# Altium schematic sheet 407-power.schdoc
size A4
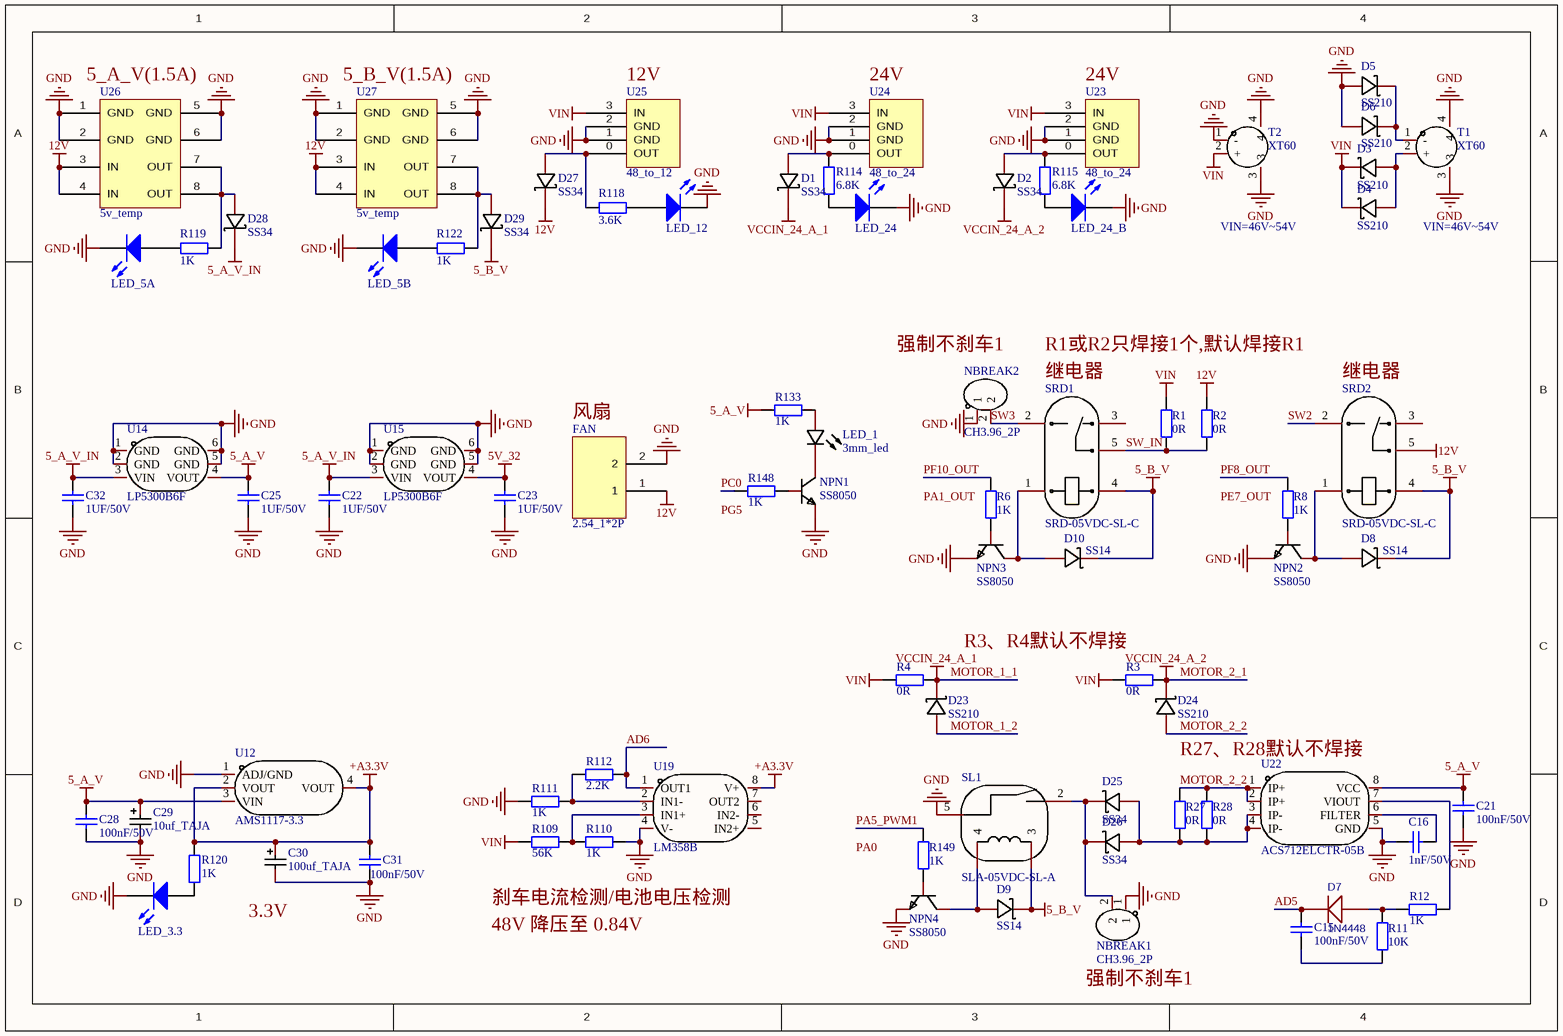
[diagram p0: 407-power.schdoc]

## Parts
C15  100nF/50V
C16  1nF/50V
C21  100nF/50V
C22  1UF/50V
C23  1UF/50V
C25  1UF/50V
C28  100nF/50V
C29  10uf_TAJA  [10uf_TAJA]
C30  100uf_TAJA  [100uf_TAJA]
C31  100nF/50V
C32  1UF/50V
D1  SS34  [SS34]
D2  SS34  [SS34]
D3  SS210  [SS210]
D4  SS210  [SS210]
D5  SS210  [SS210]
D6  SS210  [SS210]
D7  1N4448
D8  SS14  [SS14]
D9  SS14  [SS14]
D10  SS14  [SS14]
D23  SS210  [SS210]
D24  SS210  [SS210]
D25  SS34  [SS34]
D26  SS34  [SS34]
D27  SS34  [SS34]
D28  SS34  [SS34]
D29  SS34  [SS34]
FAN  2.54_1*2P  [2.54_1*2P]
LED_1  3mm_led  [3mm_led]
LED_3.3  LED  [LED]  (value not drawn)
LED_5A  LED  [LED]  (value not drawn)
LED_5B  LED  [LED]  (value not drawn)
LED_12  LED  [LED]  (value not drawn)
LED_24  LED  [LED]  (value not drawn)
LED_24_B  LED  [LED]  (value not drawn)
NBREAK1  CH3.96_2P  [CH3.96_2P]
NBREAK2  CH3.96_2P
NPN1  SS8050  [SS8050]
NPN2  SS8050  [SS8050]
NPN3  SS8050  [SS8050]
NPN4  SS8050  [SS8050]
R1  0R  [R1206_M]
R2  0R  [R1206_M]
R3  0R  [R1206_M]
R4  0R  [R1206_M]
R6  1K
R8  1K
R11  10K
R12  1K
R27  0R  [R1206_M]
R28  0R  [R1206_M]
R109  56K  [R0603_L]
R110  1K  [R0603_L]
R111  1K  [R0603_L]
R112  2.2K  [R0603_L]
R114  6.8K
R115  6.8K
R118  3.6K
R119  1K
R120  1K
R122  1K
R133  1K
R148  1K
R149  1K
SL1  SLA-05VDC-SL-A  [SLA-05VDC-SL-A]
SRD1  SRD-05VDC-SL-C  [SRD-05VDC-SL-C]
SRD2  SRD-05VDC-SL-C  [SRD-05VDC-SL-C]
T1  XT60
T2  XT60
U12  AMS1117-3.3  [AMS1117-3.3]
U14  LP5300B6F  [LP5300B6F]
U15  LP5300B6F  [LP5300B6F]
U19  LM358B  [LM358B]
U22  ACS712ELCTR-05B  [ACS712ELCTR-05B]
U23  48_to_24  [48_to_24]
U24  48_to_24  [48_to_24]
U25  48_to_12  [48_to_12]
U26  5v_temp  [5v_temp]
U27  5v_temp  [5v_temp]

## Nets
5_A_V: C21.2 C25.2 C28.1 C29.1 R133.2 U12.3(VIN) U14.4(VOUT) U22.8(VCC)
5_A_V_IN: C22.2 C32.2 D28.1(K) U14.3(VIN) U15.3(VIN)
5_B_V: D8.1(K) D9.1(K) D10.1(K) D29.1(K) SL1.3 SRD1.4 SRD2.4
5V_32: C23.2 U15.4(VOUT)
12V: D27.1(K) FAN.1 R2.1 SRD2.5 U26.3(IN) U26.4(IN) U27.3(IN) U27.4(IN)
+A3.3V: C30.1 C31.1 R120.1 U12.2(VOUT) U12.4(VOUT) U19.8(V+)
GND: C16.2 C21.1 C22.1 C23.1 C25.1 C28.2 C29.2 C30.2 C31.2 C32.1 D5.2(A) D6.2(A) FAN.2 LED_3.3.2(K) LED_5A.2(K) LED_5B.2(K) LED_12.2(K) LED_24.2(K) LED_24_B.2(K) NBREAK1.1 NBREAK2.1 NPN1.2(E) NPN2.2(E) NPN3.2(E) NPN4.2(E) R110.1 R111.2 SL1.5 T1.3 T1.4 T2.1(-) T2.3 T2.4 U12.1(ADJ/GND) U14.1(GND) U14.2(GND) U14.5(GND) U14.6(GND) U15.1(GND) U15.2(GND) U15.5(GND) U15.6(GND) U19.4(V-) U22.5(GND) U23.1(GND) U23.2(GND) U24.1(GND) U24.2(GND) U25.1(GND) U25.2(GND) U26.1(GND) U26.2(GND) U26.5(GND) U26.6(GND) U27.1(GND) U27.2(GND) U27.5(GND) U27.6(GND)
MOTOR_1_1: D1.1(K) D23.1(K) R4.1  [also labelled VCCIN_24_A_1]
MOTOR_2_1: D2.1(K) D24.1(K) R3.1  [also labelled VCCIN_24_A_2]
VIN: D3.1(K) D4.1(K) R1.2 R3.2 R4.2 R109.2 T2.2(+) U23.3(IN) U24.3(IN) U25.3(IN)
AD5: C15.1 D7.1(K)
AD6: R112.1 U19.1(OUT1)
MOTOR_1_2: D23.2(A)
MOTOR_2_2: D24.2(A) R27.2 R28.2 U22.1(IP+) U22.2(IP+)
PA5_PWM1: R149.1
PC0: R148.1
PF8_OUT: R8.1
PF10_OUT: R6.1
SW2: SRD2.2
SW3: NBREAK2.2 SRD1.2
SW_IN: R1.1 R2.2 SRD1.5
NetC15_2: C15.2 R11.2
NetC16_1: C16.1 U22.6(FILTER)
NetD1_2: D1.2(A) R114.1 U24.0(OUT)
NetD2_2: D2.2(A) R115.1 U23.0(OUT)
NetD3_2: D3.2(A) D4.2(A) T1.2(+)
NetD5_1: D5.1(K) D6.1(K) T1.1(-)
NetD7_2: D7.2(A) R11.1 R12.1
NetD8_2: D8.2(A) NPN2.3(C) SRD2.1
NetD9_2: D9.2(A) NPN4.3(C) SL1.4
NetD10_2: D10.2(A) NPN3.3(C) SRD1.1
NetD25_1: D25.1(K) D26.1(K) NBREAK1.2 SL1.2
NetD25_2: D25.2(A) D26.2(A) R27.1 R28.1 U22.3(IP-) U22.4(IP-)
NetD27_2: D27.2(A) R118.1 U25.0(OUT)
NetD28_2: D28.2(A) R119.1 U26.7(OUT) U26.8(OUT)
NetD29_2: D29.2(A) R122.2 U27.7(OUT) U27.8(OUT)
NetLED_1_1: LED_1.1(A) R133.1
NetLED_1_2: LED_1.2(K) NPN1.3(C)
NetLED_3.3_1: LED_3.3.1(A) R120.2
NetLED_5A_1: LED_5A.1(A) R119.2
NetLED_5B_1: LED_5B.1(A) R122.1
NetLED_12_1: LED_12.1(A) R118.2
NetLED_24_1: LED_24.1(A) R114.2
NetLED_24_B_1: LED_24_B.1(A) R115.2
NetNPN1_1: NPN1.1(B) R148.2
NetNPN2_1: NPN2.1(B) R8.2
NetNPN3_1: NPN3.1(B) R6.2
NetNPN4_1: NPN4.1(B) R149.2
NetR12_2: R12.2 U22.7(VIOUT)
NetR109_1: R109.1 R110.2 U19.3(IN1+)
NetR111_1: R111.1 R112.2 U19.2(IN1-)

Not connected (* = marked no-connect by the designer): SRD1 3; SRD2 3; U19 5(IN2+) 6(IN2-) 7(OUT2)

## Notes on the sheet
- (near U26) 5_A_V(1.5A)
- (near U27) 5_B_V(1.5A)
- (near U25) 12V
- (near U24) 24V
- (near U23) 24V
- VIN=46V~54V
- 强制不刹车1
- 继电器
- R1或R2只焊接1个,默认焊接R1
- (near SRD2) 继电器
- (near FAN) 风扇
- R3、R4默认不焊接
- R27、R28默认不焊接
- (near C30) 3.3V
- 刹车电流检测/电池电压检测
- 48V 降压至 0.84V
- Labels drawn without touching a wire or pin: PA0, PA1_OUT, PE7_OUT, PG5

## Library data of the parts
C15 C16 C21-C23 C25 C28 C31 C32 = Cap: Capacitor; Published: 8-Jun-2000; LatestRevisionDate: 17-Jul-2002; LatestRevisionNote: Re-released for DXP Platform.; PackageReference: RAD-0.3; Publisher: Altium Limited; PackageDescription: Radial Cap, Thru-Hole; 2 Leads; 0.3 in Pin Spacing
  C15 C21 C28 C31: Value: 100nF/50V
  C16: Value: 1nF/50V
  C22 C23 C25 C32: Value: 1UF/50V
D7 = 1N4448: Manufacturer: Diodes Inc; Manufacturer Part: 1N4448HLP-7; Link: https://www.diodes.com/assets/Datasheets/ds30590.pdf; Digikey: 1N4448HLPDICT-ND; Avnet: 1N4448HLP-7; spicePre: D; spiceSymbolName: 1N4448
LED_3.3 LED_5A LED_5B LED_12 LED_24 LED_24_B = LED: 发光二极管; 封装库来自淘宝卖家ID：黄晶宝石: 其他店铺购入均为盗版封装库，请立即申请退款，本店现金奖励20~200元
R1-R4 R6 R8 R12 R27 R28 R133 R148 R149 = Res2: Resistor; Published: 8-Jun-2000; LatestRevisionDate: 17-Jul-2002; LatestRevisionNote: Re-released for DXP Platform.; PackageReference: AXIAL-0.4; Publisher: Altium Limited; PackageDescription: Axial Device, Thru-Hole; 2 Leads; 0.4 in Pin Spacing
  R1-R4 R27 R28: Value: 0R
  R6 R8 R12 R133 R148 R149: Value: 1K
R11 = Res2: Resistor; Value: 1K; Published: 8-Jun-2000; LatestRevisionDate: 17-Jul-2002; LatestRevisionNote: Re-released for DXP Platform.; PackageReference: AXIAL-0.4; Publisher: Altium Limited; PackageDescription: Axial Device, Thru-Hole; 2 Leads; 0.4 in Pin Spacing
R109-R112 = Res2: Resistor; Value: 0K; Published: 8-Jun-2000; LatestRevisionDate: 17-Jul-2002; LatestRevisionNote: Re-released for DXP Platform.; PackageReference: AXIAL-0.4; Publisher: Altium Limited; PackageDescription: Axial Device, Thru-Hole; 2 Leads; 0.4 in Pin Spacing
R114 R115 R118-R120 R122 = R: 贴片电阻; 联系卖家，免费查找封装: 唯一出售店铺网址https://shop463601444.taobao.com; BOM名称: 贴片电阻